# Altium schematic sheet sensors_and_led.SchDoc
size A4; SheetNumber: 6; SheetTotal: 6
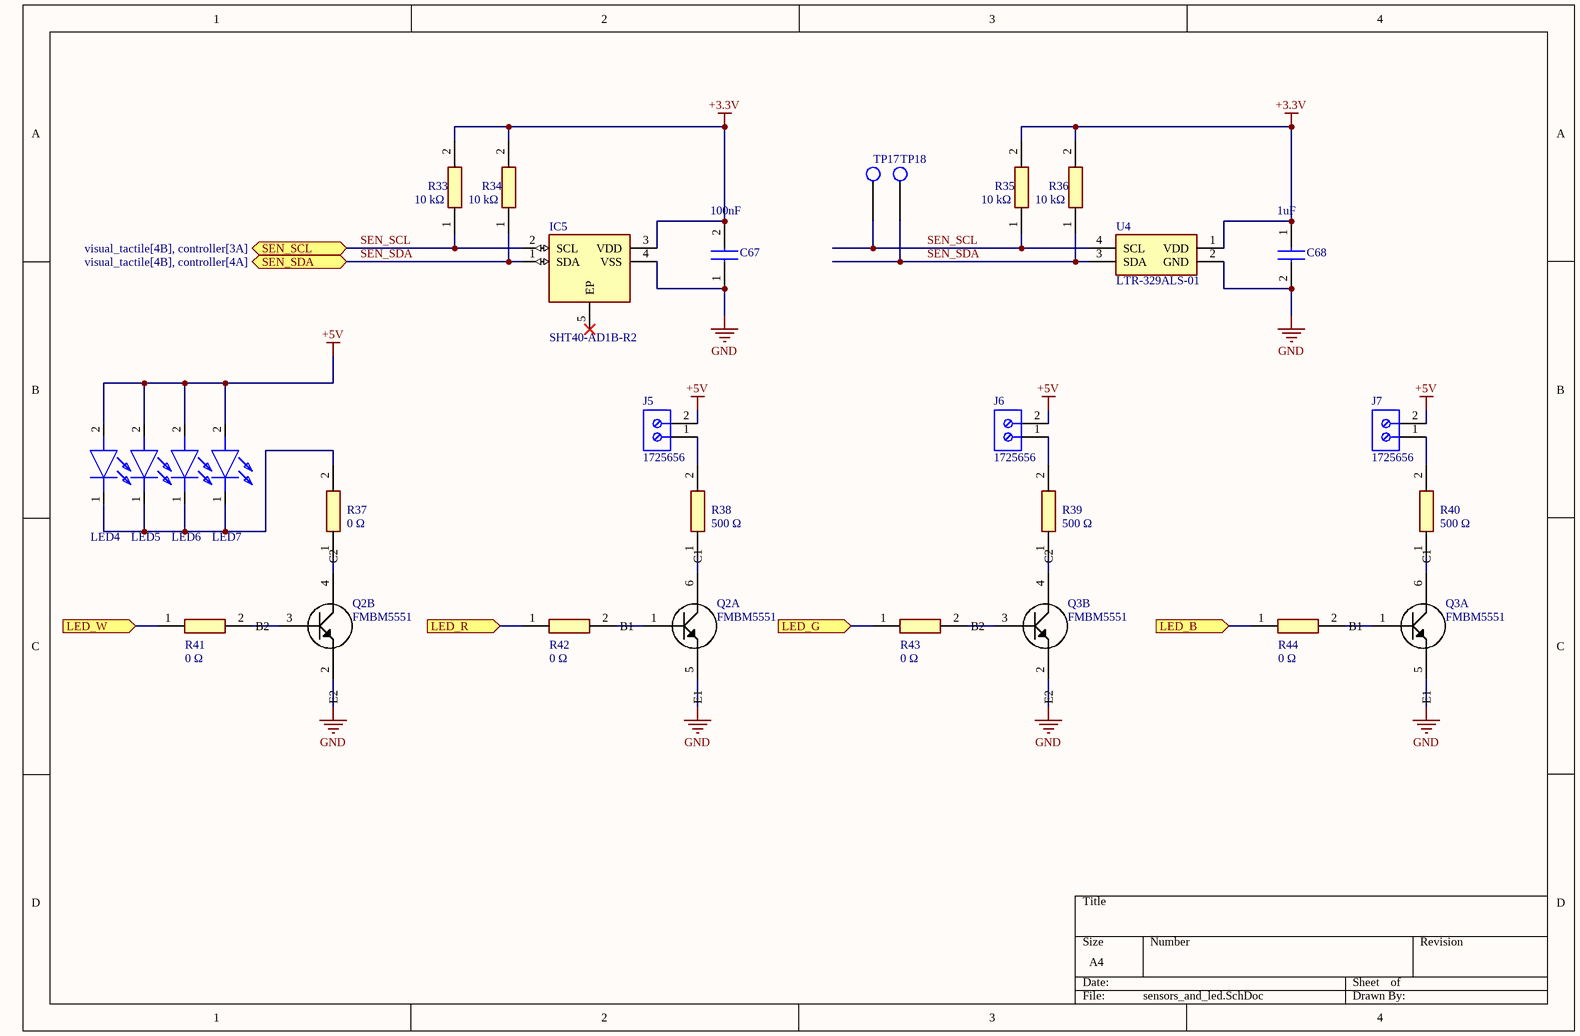
[diagram p0: sensors_and_led.SchDoc]

## Parts
C67  value 100nF  [CAPC1608X87N]  (hidden comment: CGA3E2X7R1H104K080AA)
C68  value 1uF  [CAPC1608X87N]  (hidden comment: 0603ZD105KAT2A)
IC5  SHT40-AD1B-R2  [SON80P150X150X59-5N]
J5  1725656  [PHOE-1725656-2]
J6  1725656  [PHOE-1725656-2]
J7  1725656  [PHOE-1725656-2]
LED4  JE2835BWT-P-U30GA0000-N0000001  [JE2835BWTPU30GA0000N0000001]  (value not drawn)
LED5  JE2835BWT-P-U30GA0000-N0000001  [JE2835BWTPU30GA0000N0000001]  (value not drawn)
LED6  JE2835BWT-P-U30GA0000-N0000001  [JE2835BWTPU30GA0000N0000001]  (value not drawn)
LED7  JE2835BWT-P-U30GA0000-N0000001  [JE2835BWTPU30GA0000N0000001]  (value not drawn)
Q2  FMBM5551  [SOT95P280X110-6N]  (parts A,B of 2)
Q3  FMBM5551  [SOT95P280X110-6N]  (parts A,B of 2)
R33  10 kΩ  [RESC1005X35N]
R34  10 kΩ  [RESC1005X35N]
R35  10 kΩ  [RESC1005X35N]
R36  10 kΩ  [RESC1005X35N]
R37  0 Ω  [RESC1005X35N]
R38  500 Ω  [RESC1005X35N]
R39  500 Ω  [RESC1005X35N]
R40  500 Ω  [RESC1005X35N]
R41  0 Ω  [RESC1005X35N]
R42  0 Ω  [RESC1005X35N]
R43  0 Ω  [RESC1005X35N]
R44  0 Ω  [RESC1005X35N]
TP17  Test point  [test point]  (value not drawn)
TP18  Test point  [test point]  (value not drawn)
U4  LTR-329ALS-01  [LTR329ALS01]

## Ports
LED_B (in, see visual_tactile[4C], controller[4A]), LED_G (in, see visual_tactile[4C], controller[3B]), LED_R (in, see visual_tactile[4C], controller[3B]), LED_W (in, see visual_tactile[4C], controller[3B]), SEN_SCL (bidir, see visual_tactile[4B], controller[3A]), SEN_SDA (bidir, see visual_tactile[4B], controller[4A])

## Nets
+3.3V: C67.2 C68.1 IC5.3(VDD) R33.2 R34.2 R35.2 R36.2 U4.1(VDD)
+5V: J5.2 J6.2 J7.2 LED4.2(A) LED5.2(A) LED6.2(A) LED7.2(A)
GND: C67.1 C68.2 IC5.4(VSS) Q2.2(E2) Q2.5(E1) Q3.2(E2) Q3.5(E1) U4.2(GND)
LED_B: R44.1 ; port LED_B
LED_G: R43.1 ; port LED_G
LED_R: R42.1 ; port LED_R
LED_W: R41.1 ; port LED_W
SEN_SCL: IC5.2(SCL) R33.1 R35.1 TP17.1 U4.4(SCL) ; port SEN_SCL
SEN_SDA: IC5.1(SDA) R34.1 R36.1 TP18.1 U4.3(SDA) ; port SEN_SDA
NetJ5_1: J5.1 R38.2
NetJ6_1: J6.1 R39.2
NetJ7_1: J7.1 R40.2
NetLED4_1: LED4.1(K) LED5.1(K) LED6.1(K) LED7.1(K) R37.2
NetQ2_1: Q2.1(B1) R42.2
NetQ2_3: Q2.3(B2) R41.2
NetQ2_4: Q2.4(C2) R37.1
NetQ2_6: Q2.6(C1) R38.1
NetQ3_1: Q3.1(B1) R44.2
NetQ3_3: Q3.3(B2) R43.2
NetQ3_4: Q3.4(C2) R39.1
NetQ3_6: Q3.6(C1) R40.1

Not connected (* = marked no-connect by the designer): IC5 5(EP)*

## Library data of the parts
C67 = C0603C300J5GACTU: Ceramic Capacitor, Multilayer, Ceramic, 50V, 10% +Tol, 10% -Tol, X7R, 15% TC, 0.1uF, Surface Mount, 0603; Manufacturer_Name: KEMET; Manufacturer: TDK; Multilayer: Yes; Reference Standard: AEC-Q200; Datasheet Link: https://content.kemet.com/datasheets/KEM_C1003_C0G_SMD.pdf; Height: 0.87mm; Manufacturer_Part_Number: C0603C300J5GACTU; Mouser Part Number: 80-C0603C300J5G; Mouser Price/Stock: https://www.mouser.co.uk/ProductDetail/KEMET/C0603C300J5GACTU?qs=KQYYlyH3z3RpeXhtJmCcMA%3D%3D; Arrow Part Number: C0603C300J5GACTU; Arrow Price/Stock: https://www.arrow.com/en/products/c0603c300j5gactu/kemet-corporation; Supplier: Rs; Supplier Part Number: 7882985P; Manufacturer Part Number: CGA3E2X7R1H104K080AA; RoHS: Yes; Category: Ceramic Capacitors; Stock: 84850; Pricing: 250=0.042, 500=0.039, 1000=0.037, 2500=0.033 (EUR); Mounting Technology: Surface Mount; Pins: 2; Dielectric Material: Ceramic; Package Shape: Rectangular; Case/Package: 0603; Terminal Finish: Nickel; Min Operating Temperature: -55°C; Max Operating Temperature: 125°C; JESD-609 Code: e3; Capacitor Type: Ceramic; Tolerance  (fill in as +-): 10%; Package Style: SMTMeter; Packaging: Tape and Reel; Tolerance (fill in as +-): 10%; Rated DC Voltage (URdc): 50V; Temperature Characteristics Code: X7R; Termination: Wraparound; Length: 1.6mm; Width: 0.8mm; Reach SVHC Compliant: Yes; RoHS Compliant: Yes; ComponentLink1URL: https://datasheet.ciiva.com:443/pdfs/VipMasterIC/IC/TDKC/TDKC-S-A0008953915/TDKC-S-A0008953915-1.pdf?src-supplier=IHS+Markit; ComponentLink1Description: https://datasheet.ciiva.com:443/pdfs/VipMasterIC/IC/TDKC/TDKC-S-A0008953915/TDKC-S-A0008953915-1.pdf?src-supplier=IHS+Markit
C68 = C0603C300J5GACTU: Ceramic Capacitor, Multilayer, Ceramic, 10V, 10% +Tol, 10% -Tol, X5R, 15% TC, 1uF, Surface Mount, 0603; Manufacturer_Name: KEMET; Manufacturer: Kyocera AVX; Multilayer: Yes; Datasheet Link: https://content.kemet.com/datasheets/KEM_C1003_C0G_SMD.pdf; Height: 0.87mm; Manufacturer_Part_Number: C0603C300J5GACTU; Mouser Part Number: 80-C0603C300J5G; Mouser Price/Stock: https://www.mouser.co.uk/ProductDetail/KEMET/C0603C300J5GACTU?qs=KQYYlyH3z3RpeXhtJmCcMA%3D%3D; Arrow Part Number: C0603C300J5GACTU; Arrow Price/Stock: https://www.arrow.com/en/products/c0603c300j5gactu/kemet-corporation; Supplier: Arrow Electronics; Supplier Part Number: 0603ZD105KAT2A; Manufacturer Part Number: 0603ZD105KAT2A; RoHS: Yes; Category: Ceramic Capacitors; Stock: 612000; Pricing: 4000=0.0155, 8000=0.014, 12000=0.0136, 20000=0.0135, 24000=0.0127, 100000=0.009 (USD); Mounting Technology: Surface Mount; Pins: 2; Dielectric Material: Ceramic; Package Shape: Rectangular; Case/Package: 0603; Terminal Finish: Nickel; Min Operating Temperature: -55°C; Max Operating Temperature: 85°C; JESD-609 Code: e3; Capacitor Type: Ceramic; Tolerance  (fill in as +-): 10%; Package Style: SMTMeter; Packaging: Tape and Reel; Tolerance (fill in as +-): 10%; Rated DC Voltage (URdc): 10V; Temperature Characteristics Code: X5R; Termination: Wraparound; Length: 1.6mm; Width: 0.81mm; Reach SVHC Compliant: Yes; RoHS Compliant: Yes; ComponentLink1URL: https://datasheet.ciiva.com:443/pdfs/VipMasterIC/IC/AVXC/AVXC-S-A0009640604/AVXC-S-A0009640604-1.pdf?src-supplier=IHS+Markit; ComponentLink1Description: https://datasheet.ciiva.com:443/pdfs/VipMasterIC/IC/AVXC/AVXC-S-A0009640604/AVXC-S-A0009640604-1.pdf?src-supplier=IHS+Markit; ComponentLink2URL: https://datasheet.ciiva.com/11787/0900766b80a45521-11787469.pdf?src-supplier=Rs; ComponentLink2Description: https://datasheet.ciiva.com/11787/0900766b80a45521-11787469.pdf?src-supplier=Rs; ComponentLink3URL: https://datasheet.ciiva.com/150/cx5r-150308.pdf?src-supplier=Digikey; ComponentLink3Description: https://datasheet.ciiva.com/150/cx5r-150308.pdf?src-supplier=Digikey; ComponentLink4URL: https://datasheet.ciiva.com/150/cx5r-150309.pdf?src-supplier=Digikey; ComponentLink4Description: https://datasheet.ciiva.com/150/cx5r-150309.pdf?src-supplier=Digikey; ComponentLink5URL: https://datasheet.ciiva.com/150/cx5r-150310.pdf?src-supplier=Digikey; ComponentLink5Description: https://datasheet.ciiva.com/150/cx5r-150310.pdf?src-supplier=Digikey; ComponentLink6URL: https://datasheet.ciiva.com/6128/84508-6128747.pdf?src-supplier=Farnell; ComponentLink6Description: https://datasheet.ciiva.com/6128/84508-6128747.pdf?src-supplier=Farnell; ComponentLink7URL: https://datasheet.ciiva.com/11462/cx5r-11462907.pdf?src-supplier=Avnet; ComponentLink7Description: https://datasheet.ciiva.com/11462/cx5r-11462907.pdf?src-supplier=Avnet; ComponentLink8URL: https://datasheet.ciiva.com/2987/cx5r-2987907.pdf?src-supplier=Avnet; ComponentLink8Description: https://datasheet.ciiva.com/2987/cx5r-2987907.pdf?src-supplier=Avnet; ComponentLink9URL: https://datasheet.ciiva.com/16200/cx5r-16200364.pdf?src-supplier=Future+Electronics; ComponentLink9Description: https://datasheet.ciiva.com/16200/cx5r-16200364.pdf?src-supplier=Future+Electronics; ComponentLink10URL: https://datasheet.ciiva.com/14604/70001028-14604907.pdf?src-supplier=Allied+Electronics; ComponentLink10Description: https://datasheet.ciiva.com/14604/70001028-14604907.pdf?src-supplier=Allied+Electronics; ComponentLink11URL: https://datasheet.ciiva.com/1458/1666675-1458205.pdf?src-supplier=Element14; ComponentLink11Description: https://datasheet.ciiva.com/1458/1666675-1458205.pdf?src-supplier=Element14; ComponentLink12URL: https://datasheet.ciiva.com/1458/1666675-1458206.pdf?src-supplier=Element14; ComponentLink12Description: https://datasheet.ciiva.com/1458/1666675-1458206.pdf?src-supplier=Element14; ComponentLink13URL: https://datasheet.ciiva.com/1458/84508-1458207.pdf?src-supplier=Element14; ComponentLink13Description: https://datasheet.ciiva.com/1458/84508-1458207.pdf?src-supplier=Element14; ComponentLink14URL: https://datasheet.ciiva.com/7855/1666675-7855113.pdf?src-supplier=Element14; ComponentLink14Description: https://datasheet.ciiva.com/7855/1666675-7855113.pdf?src-supplier=Element14
IC5 = SHT40-AD1B-R2: Integrated Circuit; Manufacturer_Name: Sensirion; Datasheet Link: https://www.mouser.dk/datasheet/2/682/Sensirion_10272020_Datasheet_SHT4x-1919523.pdf; Height: 0.59mm; Manufacturer_Part_Number: SHT40-AD1B-R2; Mouser Part Number: 403-SHT40-AD1B-R2; Mouser Price/Stock: https://www.mouser.co.uk/ProductDetail/Sensirion/SHT40-AD1B-R2?qs=zW32dvEIR3scTT6A4VuzaQ%3D%3D; Arrow Part Number: SHT40-AD1B-R2; Arrow Price/Stock: https://www.arrow.com/en/products/sht40-ad1b-r2/sensirion-ag?region=nac
J5-J7 = CMP-2000-05299-1: Male Header, Pitch 2.54 mm, 1 x 2 Position, Height 9 mm, Tail Length 3.5 mm; Manufacturer: Phoenix Contact; Number of contacts: 2; Content: 250pc(s); Pitch: 2.54mm; Industrial packaging: Yes; Colour: Green; Manufacturer part No.: 1725656; Type: MPT0,5/2-2,54; Datasheet URL: http://datasheet.octopart.com/1725656-Phoenix-Contact-datasheet-5302866.pdf; Manufacturer URL: http://www.phoenixcontact.com/; Datasheet Version: Apr-08
LED4-LED7 = JE2835BWT-P-U30GA0000-N0000001: LED; Manufacturer_Name: CREE LED; Manufacturer_Part_Number: JE2835BWT-P-U35GA0000-N0000001; Datasheet Link: https://th.mouser.com/datasheet/2/723/JSeries_2835_3V_Consolidated-2940268.pdf; Mouser Part Number: 941-JE2835BWTPU30GAN; Mouser Price/Stock: https://www.mouser.co.uk/ProductDetail/Cree-Inc/JE2835BWT-P-U30GA0000-N0000001/?qs=wnTfsH77Xs7%2FtRTpVd%252BPCA%3D%3D; Arrow Part Number: JE2835BWT-P-U30GA0000-N0000001; Arrow Price/Stock: https://www.arrow.com/en/products/je2835bwt-p-u30ga0000-n0000001/cree
Q2 Q3 = FMBM5551: Transistor NPN/NPN BISS; Manufacturer_Name: onsemi; Datasheet Link: https://www.onsemi.com/pdf/datasheet/fmbm5551-d.pdf; Height: 1.1mm; Manufacturer_Part_Number: FMBM5551; Mouser Part Number: 512-FMBM5551; Mouser Price/Stock: https://www.mouser.co.uk/ProductDetail/onsemi-Fairchild/FMBM5551?qs=VOMQJJE%252BBNnHm%2F5A44uOUQ%3D%3D; Arrow Part Number: FMBM5551; Arrow Price/Stock: https://www.arrow.com/en/products/fmbm5551/on-semiconductor?region=nac
R33-R44 = CPF0402B100KE: Resistor; Manufacturer_Name: TE Connectivity; Datasheet Link: http://www.farnell.com/datasheets/1786775.pdf; Height: 0.35mm; Manufacturer_Part_Number: CPF0402B100KE; Mouser Part Number: 279-CPF0402B100KE; Mouser Price/Stock: https://www.mouser.co.uk/ProductDetail/TE-Connectivity-Holsworthy/CPF0402B100KE?qs=CXI0wBT1M2h4W2Gm72yIGA%3D%3D; Arrow Part Number: CPF0402B100KE; Arrow Price/Stock: https://www.arrow.com/en/products/cpf0402b100ke/te-connectivity?region=nac
U4 = LTR-329ALS-01: Undefined or Miscellaneous; Manufacturer_Name: Lite-On; Datasheet Link: http://www.mouser.com/ds/2/239/liteon_LTR-329ALS-01-1175539.stp; Height: 0mm; Manufacturer_Part_Number: LTR-329ALS-01; Mouser Part Number: 859-LTR-329ALS-01; Mouser Price/Stock: https://www.mouser.co.uk/ProductDetail/Lite-On/LTR-329ALS-01?qs=Ml%2FaxAEbwm8eHg8LIDPUrw%3D%3D; Arrow Part Number: LTR-329ALS-01; Arrow Price/Stock: https://www.arrow.com/en/products/ltr-329als-01/lite-on-technology?region=nac